# EAGLE schematic RobomasSwerve (EAGLE 9.7.0)

## Sheet 1 of 2
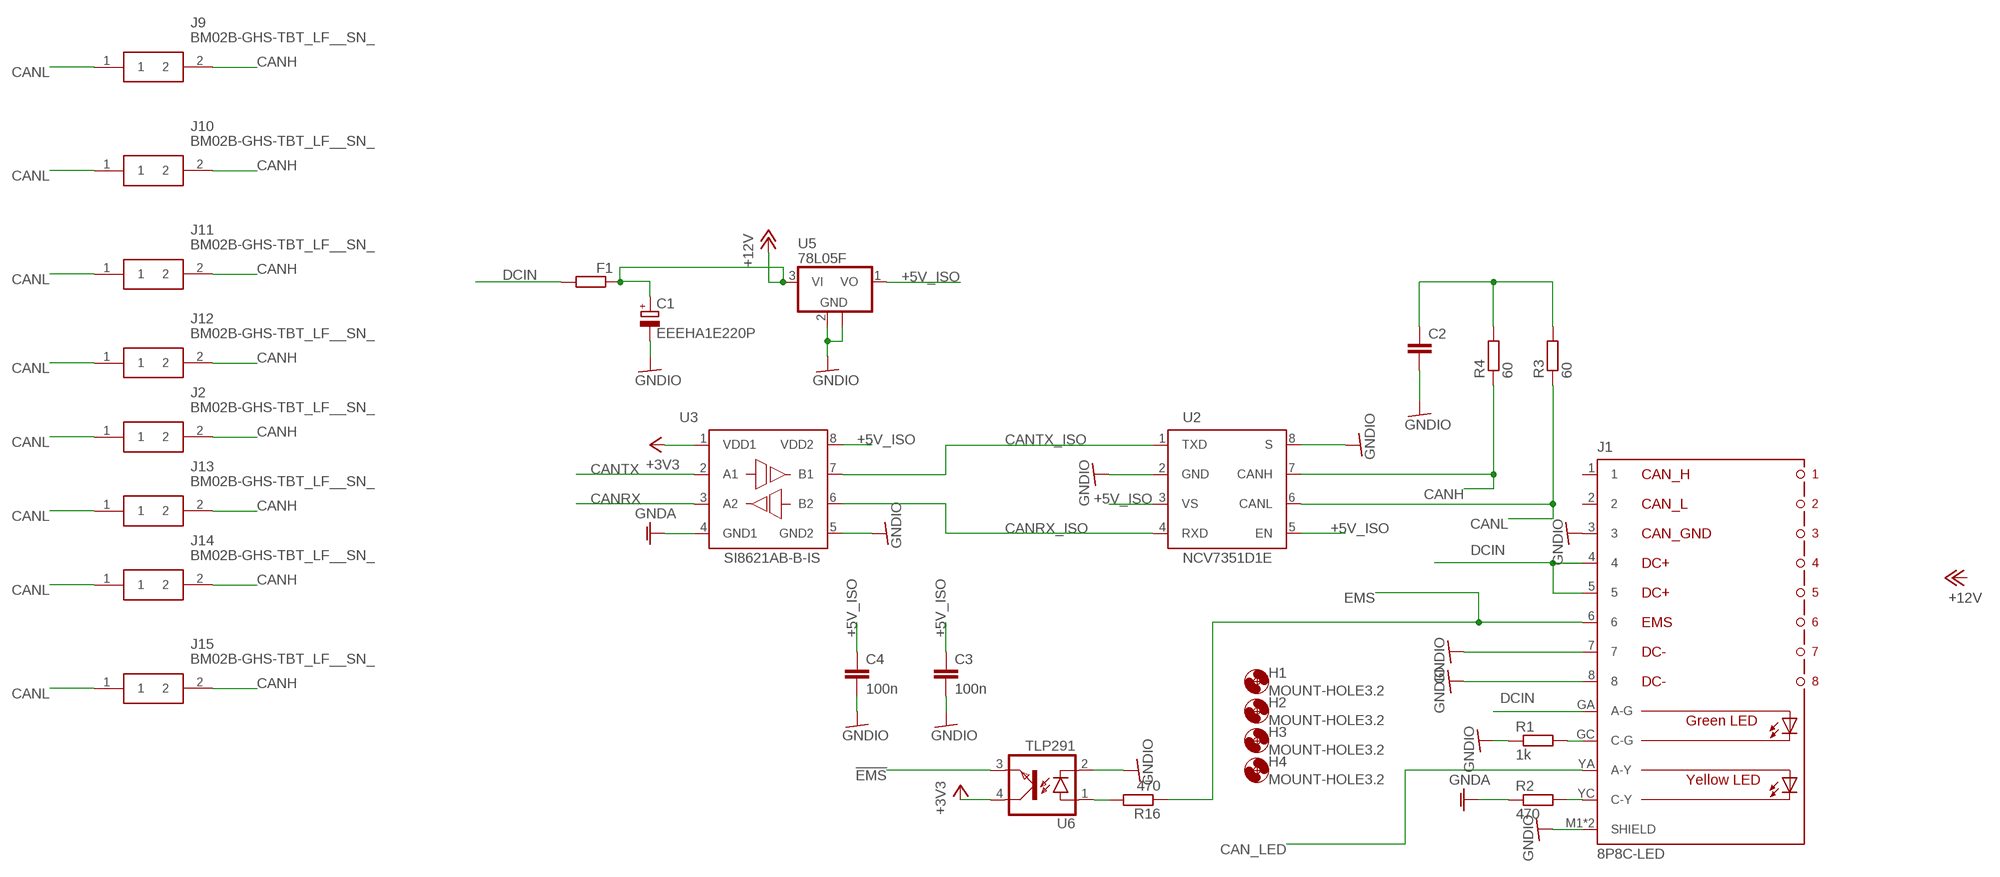
[diagram p0: schematic, sheet 1]

### Parts
C1  EEEHA1E220P  CPOL-EU153CLV-0605  [153CLV-0605]
C2  C-EUC0603  [C0603]
C3  100n  C-EUC0603  [C0603]
C4  100n  C-EUC0603  [C0603]
F1  R-EU_R1206  [R1206]
H1  MOUNT-HOLE3.2  [3,2]
H2  MOUNT-HOLE3.2  [3,2]
H3  MOUNT-HOLE3.2  [3,2]
H4  MOUNT-HOLE3.2  [3,2]
J1  8P8C-LED  [8P8C-LED]
J2  BM02B-GHS-TBT_LF__SN_  [BM02B-GHS-TBT_1]
J9  BM02B-GHS-TBT_LF__SN_  [BM02B-GHS-TBT_1]
J10  BM02B-GHS-TBT_LF__SN_  [BM02B-GHS-TBT_1]
J11  BM02B-GHS-TBT_LF__SN_  [BM02B-GHS-TBT_1]
J12  BM02B-GHS-TBT_LF__SN_  [BM02B-GHS-TBT_1]
J13  BM02B-GHS-TBT_LF__SN_  [BM02B-GHS-TBT_1]
J14  BM02B-GHS-TBT_LF__SN_  [BM02B-GHS-TBT_1]
J15  BM02B-GHS-TBT_LF__SN_  [BM02B-GHS-TBT_1]
R1  1k  R-EU_R0603  [R0603]
R2  470  R-EU_R0603  [R0603]
R3  60  R-EU_R0603  [R0603]
R4  60  R-EU_R0603  [R0603]
R16  470  R-EU_R0603  [R0603]
U2  NCV7351D1E  [SO08]
U3  SI8621AB-B-IS  [SO08]
U5  78L05F  [SOT89]
U6  TLP291  [MINI-FLAT-4]

### Nets
!EMS: U6.3(EMIT) ; also sheet 2
+3V3: U3.1(VDD1) U6.4(COL) ; also sheet 2
+5V_ISO [wide]: C3.1 C4.1 U2.3(VS) U2.5(EN) U3.8(VDD2) U5.1(VO)
+12V [1A]: C1.+ F1.1 U5.3(VI)
CAN_LED: J1.YA(A-Y) ; also sheet 2
CANH: J2.2 J9.2 J10.2 J11.2 J12.2 J13.2 J14.2 J15.2 R4.1 U2.7(CANH)
CANL: J2.1 J9.1 J10.1 J11.1 J12.1 J13.1 J14.1 J15.1 R3.1 U2.6(CANL)
CANRX: U3.3(A2) ; also sheet 2
CANRX_ISO: U2.4(RXD) U3.6(B2)
CANTX: U3.2(A1) ; also sheet 2
CANTX_ISO: U2.1(TXD) U3.7(B1)
DCIN [1A]: F1.2 J1.4 J1.5 J1.GA(A-G)
EMS: J1.6 R16.1
GNDA: R2.1 U3.4(GND1) ; also sheet 2
GNDIO: C1.- C2.2 C3.2 C4.2 J1.3 J1.7 J1.8 J1.M1(SHIELD) J1.M2(SHIELD) R1.1 U2.2(GND) U2.8(S) U3.5(GND2) U5.2(GND) U5.2@1(GND) U6.2(C)
N$3: J1.GC(C-G) R1.2
N$4: J1.YC(C-Y) R2.2
N$6: C2.1 R3.2 R4.2
N$25: R16.2 U6.1(A)
Unconnected: J1.1 J1.2

## Sheet 2 of 2
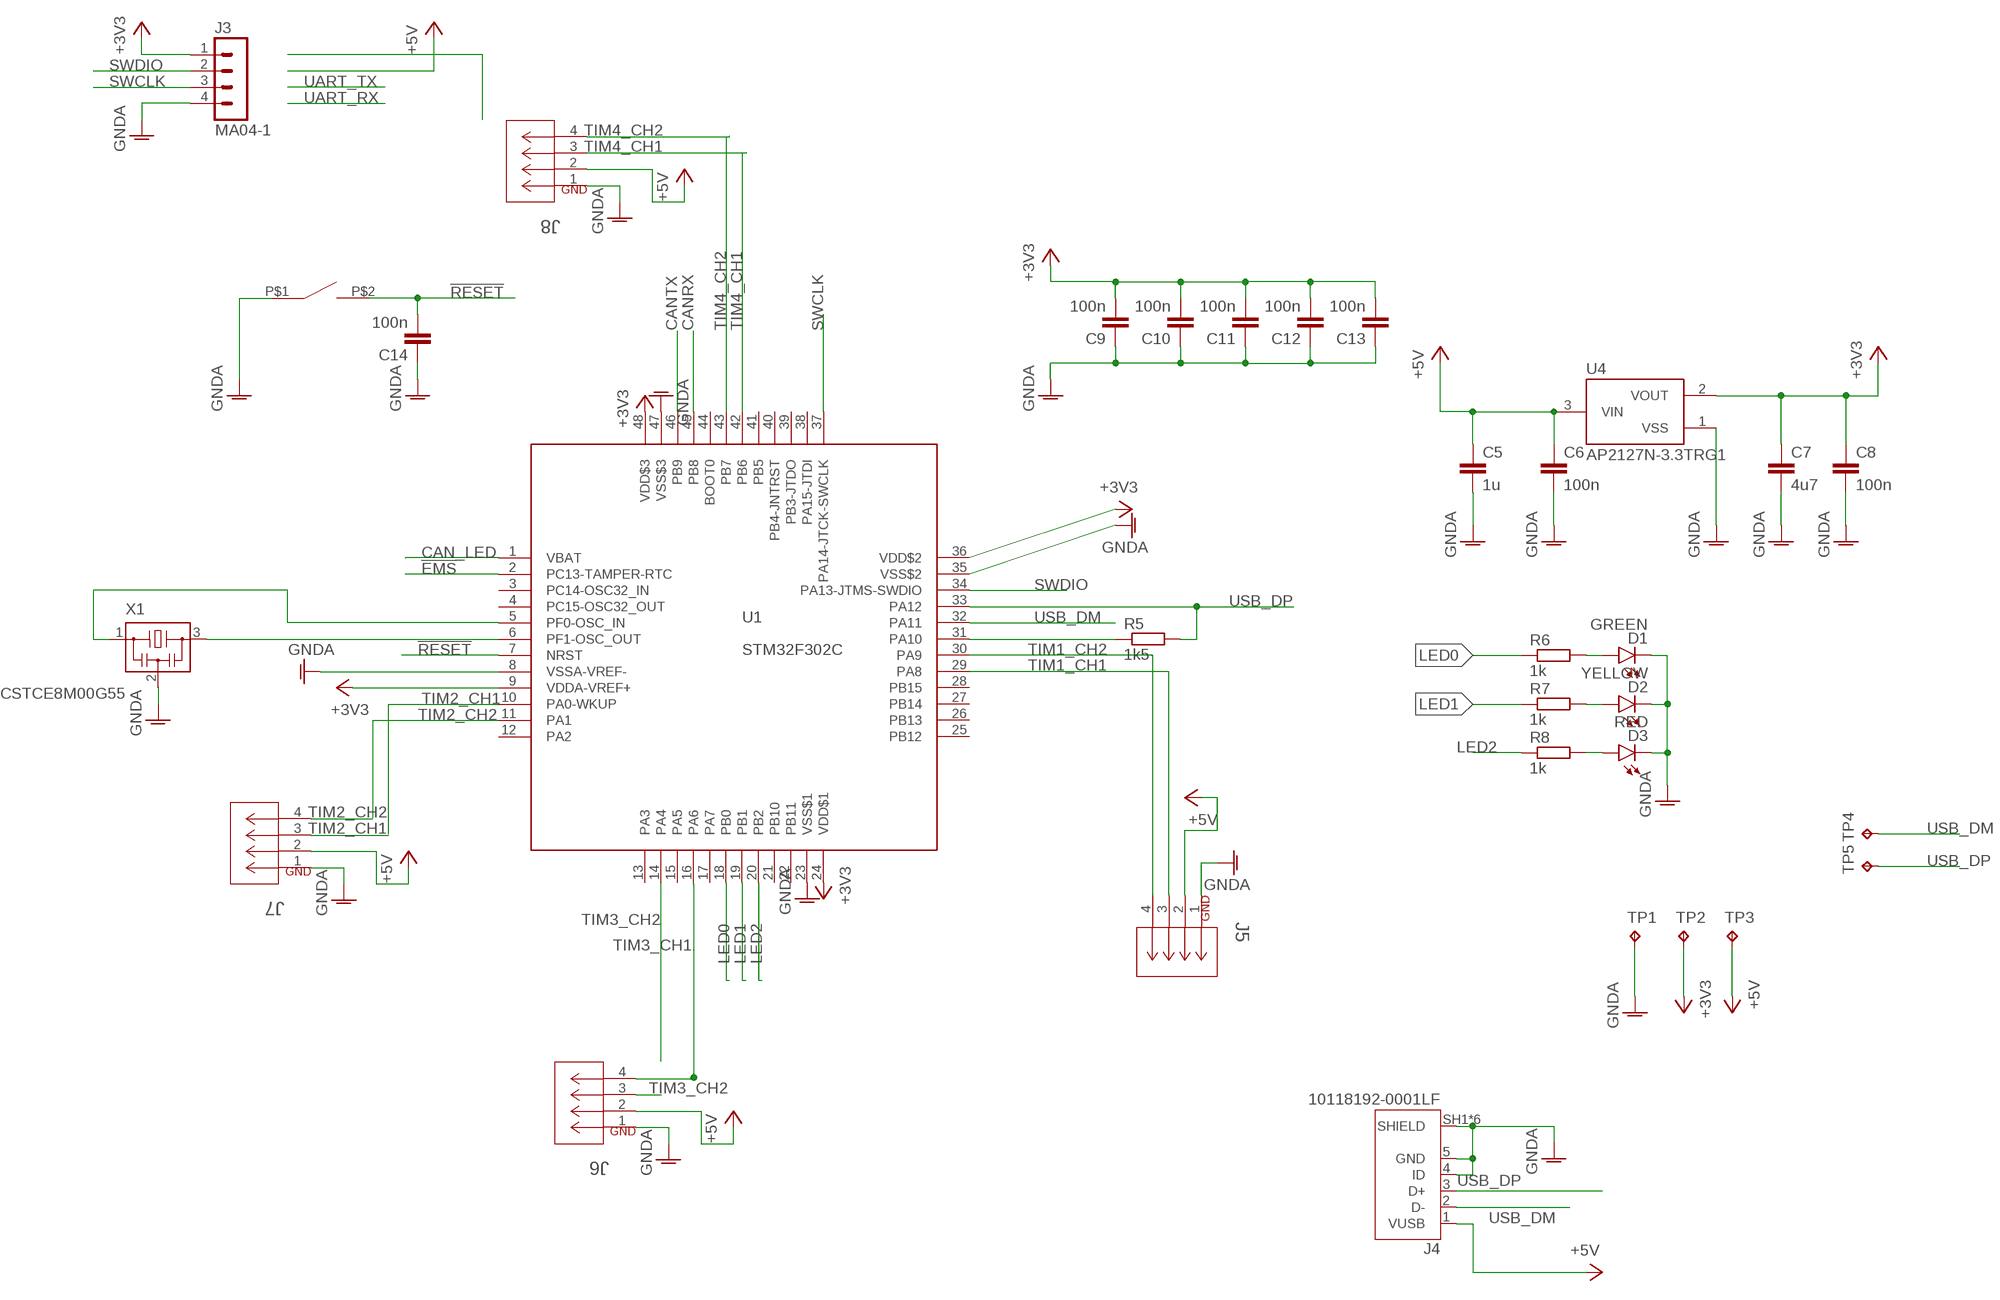
[diagram p1: schematic, sheet 2]

### Parts
C5  1u  C-EUC0603  [C0603]
C6  100n  C-EUC0603  [C0603]
C7  4u7  C-EUC0805  [C0805]
C8  100n  C-EUC0603  [C0603]
C9  100n  C-EUC0603  [C0603]
C10  100n  C-EUC0603  [C0603]
C11  100n  C-EUC0603  [C0603]
C12  100n  C-EUC0603  [C0603]
C13  100n  C-EUC0603  [C0603]
C14  100n  C-EUC0603  [C0603]
D1  GREEN  LEDCHIPLED_0805  [CHIPLED_0805]
D2  YELLOW  LEDCHIPLED_0805  [CHIPLED_0805]
D3  RED  LEDCHIPLED_0805  [CHIPLED_0805]
J3  MA04-1  [MA04-1]
J4  10118192-0001LF  [AMPHENOL_10118192-0001LF]
J5  EP2.5-4-SIDE  [CONN4_1744426-4]
J6  EP2.5-4-SIDE  [CONN4_1744426-4]
J7  EP2.5-4-SIDE  [CONN4_1744426-4]
J8  EP2.5-4-SIDE  [CONN4_1744426-4]
R5  1k5  R-EU_R0603  [R0603]
R6  1k  R-EU_R0603  [R0603]
R7  1k  R-EU_R0603  [R0603]
R8  1k  R-EU_R0603  [R0603]
S1  SWITCH_TACTILETOP  [SWITCH_TACTILE_3X6]
TP1  TPB1,27  [B1,27]
TP2  TPB1,27  [B1,27]
TP3  TPB1,27  [B1,27]
TP4  TPB1,27  [B1,27]
TP5  TPB1,27  [B1,27]
U1  STM32F302C  STM32F303C  [LQFP48]
U4  AP2127N-3.3TRG1  XC6206  [SOT95P240X110-3]
X1  CSTCE8M00G55  [CSTCE8M00G55]

### Nets
!EMS: U1.2(PC13-TAMPER-RTC) ; also sheet 1
!RESET: C14.2 S1.P$2 U1.7(NRST)
+3V3: C7.1 C8.1 C9.2 C10.2 C11.2 C12.2 C13.2 J3.1 TP2.TP U1.9(VDDA-VREF+) U1.24(VDD$1) U1.36(VDD$2) U1.48(VDD$3) U4.2(VOUT) ; also sheet 1
+5V [wide]: C5.1 C6.1 J4.1(VUSB) J5.2 J6.2 J7.2 J8.2 TP3.TP U4.3(VIN)
CAN_LED: U1.1(VBAT) ; also sheet 1
CANRX: U1.45(PB8) ; also sheet 1
CANTX: U1.46(PB9) ; also sheet 1
GNDA: C5.2 C6.2 C7.2 C8.2 C9.1 C10.1 C11.1 C12.1 C13.1 C14.1 D1.C D2.C D3.C J3.4 J4.4(ID) J4.5(GND) J4.SH1(SHIELD) J4.SH2(SHIELD) J4.SH3(SHIELD) J4.SH4(SHIELD) J4.SH5(SHIELD) J4.SH6(SHIELD) J5.1 J6.1 J7.1 J8.1 S1.P$1 TP1.TP U1.8(VSSA-VREF-) U1.23(VSS$1) U1.35(VSS$2) U1.47(VSS$3) U4.1(VSS) X1.2 ; also sheet 1
LED0: R6.1 U1.18(PB0)
LED1: R7.1 U1.19(PB1)
LED2: R8.1 U1.20(PB2)
N$2: D2.A R7.2
N$5: D1.A R6.2
N$7: U1.6(PF1-OSC_OUT) X1.3
N$8: U1.5(PF0-OSC_IN) X1.1
N$11: R5.1 U1.31(PA10)
N$21: D3.A R8.2
SWCLK: J3.3 U1.37(PA14-JTCK-SWCLK)
SWDIO: J3.2 U1.34(PA13-JTMS-SWDIO)
TIM1_CH1: J5.3 U1.29(PA8)
TIM1_CH2: J5.4 U1.30(PA9)
TIM2_CH1: J7.3 U1.10(PA0-WKUP)
TIM2_CH2: J7.4 U1.11(PA1)
TIM3_CH1: J6.4 U1.16(PA6)
TIM3_CH2: J6.3 U1.14(PA4)
TIM4_CH1: J8.3 U1.42(PB6)
TIM4_CH2: J8.4 U1.43(PB7)
USB_DM: J4.2(D-) TP4.TP U1.32(PA11)
USB_DP: J4.3(D+) R5.2 TP5.TP U1.33(PA12)
Unconnected: U1.3(PC14-OSC32_IN) U1.4(PC15-OSC32_OUT) U1.12(PA2) U1.13(PA3) U1.15(PA5) U1.17(PA7) U1.21(PB10) U1.22(PB11) U1.25(PB12) U1.26(PB13) U1.27(PB14) U1.28(PB15) U1.38(PA15-JTDI) U1.39(PB3-JTDO) U1.40(PB4-JNTRST) U1.41(PB5) U1.44(BOOT0)

## Library data of the parts
C1 = rcl:CPOL-EU: POLARIZED CAPACITOR, European symbol; SPICEPREFIX: C
C2-C4 = rcl:C-EU: CAPACITOR, European symbol; SPICEPREFIX: C
C5-C14 = rcl:C-EU: CAPACITOR, European symbol
D1-D3 = led:LED: LED OSRAM: - CHIPLED LG R971, LG N971, LY N971, LG Q971, LY Q971, LO R971, LY R971 LH N974, LH R974 LS Q976, LO Q976, LY Q976 LO Q996 - Hyper CHIPLED LW Q18S LB Q993, LB Q99A, LB R99A - SideLED LS A670, LO A670, LY A670, LG A670, LP A670 LB A673, LV A673, LT A673, LW A673 LH A674 LY A675 LS A676, LA A676, LO A676, LY A676, LW A676 LS A679, LY A679, LG A679 - Hyper Micro SIDELED® LS Y876, LA Y876, LO Y876, LY Y876 LT Y87S - SmartLED LW L88C, LW L88S LB L89C, LB L89S, LG L890 LS L89K, LO L89K, LY L89K LS L896, LA L896, LO L896, LY L896 - TOPLED LS T670, LO T670, LY T670, LG T670, LP T670 LSG T670, LSP T670, LSY T670, LOP T670, LYG T670 LG T671, LOG T671, LSG T671 LB T673, LV T673, LT T673, LW T673 LH T674 LS T676, LA T676, LO T676, LY T676, LB T676, LH T676, LSB T676, LW T676 LB T67C, LV T67C, LT T67C, LS T67K, LO T67K, LY T67K, LW E67C LS E67B, LA E67B, LO E67B, LY E67B, LB E67C, LV E67C, LT E67C LW T67C LS T679, LY T679, LG T679 LS T770, LO T770, LY T770, LG T770, LP T770 LB T773, LV T773, LT T773, LW T773 LH T774 LS E675, LA E675, LY E675, LS T675 LS T776, LA T776, LO T776, LY T776, LB T776 LHGB T686 LT T68C, LB T68C - Hyper Mini TOPLED® LB M676 - Mini TOPLED Santana® LG M470 LS M47K, LO M47K, LY M47K Source: http://www.osram.convergy.de LUXEON: - LUMILED® LXK2-PW12-R00, LXK2-PW12-S00, LXK2-PW14-U00, LXK2-PW14-V00 LXK2-PM12-R00, LXK2-PM12-S00, LXK2-PM14-U00 LXK2-PE12-Q00, LXK2-PE12-R00, LXK2-PE12-S00, LXK2-PE14-T00, LXK2-PE14-U00 LXK2-PB12-K00, LXK2-PB12-L00, LXK2-PB12-M00, LXK2-PB14-N00, LXK2-PB14-P00, LXK2-PB14-Q00 LXK2-PR12-L00, LXK2-PR12-M00, LXK2-PR14-Q00, LXK2-PR14-R00 LXK2-PD12-Q00, LXK2-PD12-R00, LXK2-PD12-S00 LXK2-PH12-R00, LXK2-PH12-S00 LXK2-PL12-P00, LXK2-PL12-Q00, LXK2-PL12-R00 Source: www.luxeon.com KINGBRIGHT: KA-3528ASYC Source: www.kingbright.com
F1 R1-R4 R16 = rcl:R-EU_: RESISTOR, European symbol; SPICEPREFIX: R
H1-H4 = holes:MOUNT-HOLE: MOUNTING HOLE with drill center marker
J1 = con-rj45:8P8C-LED: generic 8P8C connector with two LED's; OC_FARNELL: unknown; OC_NEWARK: unknown
J2 J9-J15 = BM02B-GHS-TBT_LF__SN_:BM02B-GHS-TBT_LF__SN_: GH 1.25mm header top entry 2 way JST GH Series, 1.25mm Pitch 2 Way Shrouded Straight PCB Header, Surface Mount, Solder Termination Source: Datasheet <http://uk.rs-online.com/web/p/products/7521762>; DESCRIPTION: GH 1.25mm header top entry 2 way JST GH Series, 1.25mm Pitch 2 Way Shrouded Straight PCB Header, Surface Mount, Solder Termination; HEIGHT: mm; MANUFACTURER_NAME: JST (JAPAN SOLDERLESS TERMINALS); MANUFACTURER_PART_NUMBER: BM02B-GHS-TBT(LF)(SN)
J3 = con-headers:MA04-1
J4 = con-usb:10118192-0001LF: Single Port 5 Contact Horizontal Right Angle Shielded Micro B USB 2.0 Connector; DESCRIPTION: USB - micro B USB 2.0 Receptacle Connector 5 Position Surface Mount, Right Angle; DIGI-KEY_PART_NUMBER: 609-4613-1-ND; DIGI-KEY_PURCHASE_URL: https://www.digikey.com/product-detail/en/amphenol-icc-fci/10118192-0001LF/609-4613-1-ND/2785378?utm_source=snapeda&utm_medium=aggregator&utm_campaign=symbol; MF: Amphenol ICC; MP: 10118192-0001LF; PACKAGE: None
J5-J8 = con-ep2.5:EP2.5-4-SIDE; MANUFACTURER_PART_NUMBER: 17444264; VENDOR: TE Connectivity
R5-R8 = rcl:R-EU_: RESISTOR, European symbol
S1 = switch-tactile:SWITCH_TACTILE
TP1-TP5 = testpad:TP: Test pad
U1 = stm32_mcu:STM32F303C*
U2 = on-semi:NCV7351D1E: High Speed CAN Transceiver Source: NCV7351-D.PDF <http://www.onsemi.com/PowerSolutions/document/NCV7351-D.PDF>
U3 = silabs:SI8621AB-B-IS: 1 Mbps Digital Isolator 1 Mbps, 2.5 kVRMS Digital Isolator Source: Si86xx.pdf <https://www.silabs.com/documents/public/data-sheets/Si86xx.pdf>
U4 = torex:XC6206
U5 = linear:78L*: POSITOIV-VOLTAGE REGULATORS Output up to 100 mA Source: Datasheet <http://focus.ti.com/lit/ds/symlink/ua78l05.pdf>
U6 = toshiba:TLP291: TOSHIBA PHOTOCOUPLER GaAs IRED & PHOTO-TRANSISTOR; OC_FARNELL: unknown; OC_NEWARK: unknown
X1 = resonator:CSTCE8M00G55

## Net classes
0 default: width 0.25 mm
1 wide: width 0.4 mm
2 1A: width 1 mm